# Altium schematic sheet Power-ATX.SchDoc
size Letter; DocumentNumber: 5; SheetNumber: 5; SheetTotal: 5
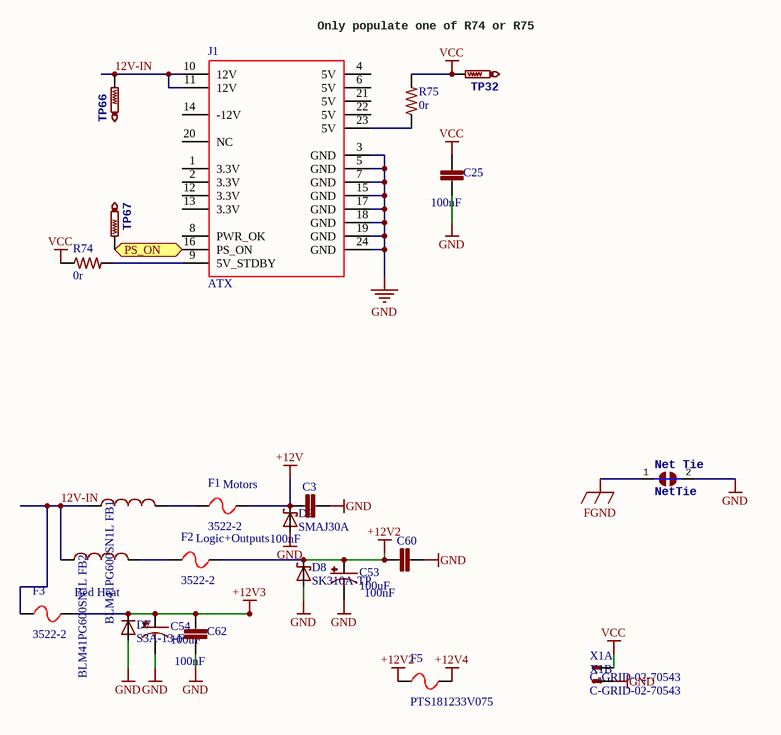
[diagram p0: Power-ATX.SchDoc]

## Parts
C3  100nF  [C0603]
C25  100nF  [C0603]
C53  100uF  [C3,5-8]
C54  100uF  [C3,5-8]
C60  100nF  [C0603]
C62  100nF  [C0603]
D2  SMAJ30A  [SMA-SM]
D7  S3A-13-F  [DO-214AB]
D8  SK310A-TP  [SMA-SM]
F1  3522-2  [3522-2]
F2  3522-2  [3522-2]
F3  3522-2  [3522-2]
F5  PTS181233V075  [PTS1812 Fuse]
FB1  BLM41PG600SN1L  [L1806]
FB2  BLM41PG600SN1L  [L1806]
J1  ATX  [ATX24]
Net_Tie  NetTie  [Net Tie]  (net tie, no BOM)
R74  0r  [R0603]
R75  0r  [R0603]
TP32  TestPoint  [TP1-27]  (value not drawn)
TP66  TestPoint  [TP1-27]  (value not drawn)
TP67  TestPoint  [TP1-27]  (value not drawn)
X1  C-GRID-02-70543  [70543-02]  (parts A,B of 2)

## Ports
PS_ON

## Nets
+12V: C3.1 D2.C F1.2
+12V2: C53.1(+) C60.1 D8.C F2.2 F5.1
+12V3: C54.1(+) C62.1 D7.C F3.2
+12V4: F5.2
FGND: Net_Tie.1
GND: C3.2 C25.2 C53.2(-) C54.2(-) C60.2 C62.2 D2.A D7.A D8.A J1.3(GND) J1.5(GND) J1.7(GND) J1.15(GND) J1.17(GND) J1.18(GND) J1.19(GND) J1.24(GND) Net_Tie.2 X1.1(S)
VCC: C25.1 R74.1 R75.2 TP32.TP X1.2(S)
12V-IN: F3.1 FB1.1 FB2.1 J1.10(12V) J1.11(12V) TP66.TP
PS_ON: J1.16(PS_ON) TP67.TP ; port PS_ON
NetF1_1: F1.1 FB1.2
NetF2_1: F2.1 FB2.2
NetJ1_9: J1.9(5V_STDBY) R74.2
NetJ1_23: J1.23(5V) R75.1

Not connected (* = marked no-connect by the designer): J1 1(3.3V) 2(3.3V) 4(5V) 6(5V) 8(PWR_OK) 12(3.3V) 13(3.3V) 14(-12V) 20(NC) 21(5V) 22(5V)

## Notes on the sheet
- Only populate one of R74 or R75
- (near F1) Motors
- Logic+Outputs
- Bed Heat

## Library data of the parts
C3 C25 C60 C62 = C0603C104K5RACTU: CAP CER 0603 100nF 50V 10% X7R; LastRevisionNote: ImportComponents; Published: 23-Apr-2014; Publisher: UltiMachine; LastRevisionDate: 23-Apr-2014; ManufacturerPartNumber: C0603C104K5RACTU; VALUE: 100nF
C53 C54 = UVZ1H101MPD1TD: CAP ALU 100uF 50V 20% 105C; LastRevisionNote: ImportComponents; Published: 23-Apr-2014; Publisher: UltiMachine; LastRevisionDate: 23-Apr-2014; ManufacturerPartNumber: UVZ1H101MPD1TD; VALUE: 100uF
D2 D8 = SMAJ30A: DIODE TVS 30V SMA; LastRevisionNote: ImportComponents; LastRevisionDate: 23-Apr-2014; ManufacturerPartNumber: SMAJ30A; Published: 23-Apr-2014; Publisher: UltiMachine
D7 = S3A-13-F: DIODE DO-214AB; LastRevisionNote: ImportComponents; Published: 23-Apr-2014; Publisher: UltiMachine; LastRevisionDate: 23-Apr-2014; Value: S3A-13-F
F1-F3 = 3522-2: FUSE PTH ATO; LastRevisionNote: ImportComponents; LastRevisionDate: 23-Apr-2014; ManufacturerPartNumber: 3522-2; Published: 23-Apr-2014; Publisher: UltiMachine
F5 = PTS181233V075: FUSE 1812 PTC 750mA 6V; LastRevisionNote: ImportComponents; Published: 23-Apr-2014; Publisher: UltiMachine; LastRevisionDate: 23-Apr-2014; ManufacturerPartNumber: PTS181233V075
FB1 FB2 = BLM41PG600SN1L: FERRITE BEAD 1806 60ohm; LastRevisionNote: ImportComponents; Published: 23-Apr-2014; Publisher: UltiMachine; LastRevisionDate: 23-Apr-2014; ManufacturerPartNumber: BLM41PG600SN1L
J1 = ATX24
Net_Tie = NetTie: Net Tie; LastRevisionNote: ImportComponents; Published: 23-Apr-2014; Publisher: UltiMachine; LastRevisionDate: 23-Apr-2014
R74 R75 = CR0603J000ELF: RES 0603 0r 100mW 1%; LastRevisionNote: ImportComponents; Published: 23-Apr-2014; Publisher: UltiMachine; LastRevisionDate: 23-Apr-2014; ManufacturerPartNumber: CR0603J000ELF; VALUE: 0r
TP32 TP66 TP67 = TestPoint: Test Point; LastRevisionNote: ImportComponents; Published: 23-Apr-2014; Publisher: UltiMachine; LastRevisionDate: 23-Apr-2014
X1 = C-GRID-02-70543: Connector 2pos 2.54mm locking; LastRevisionNote: ImportComponents; LastRevisionDate: 23-Apr-2014; Published: 23-Apr-2014; Publisher: UltiMachine